# Altium project Antenna-V1.1.PrjPcb
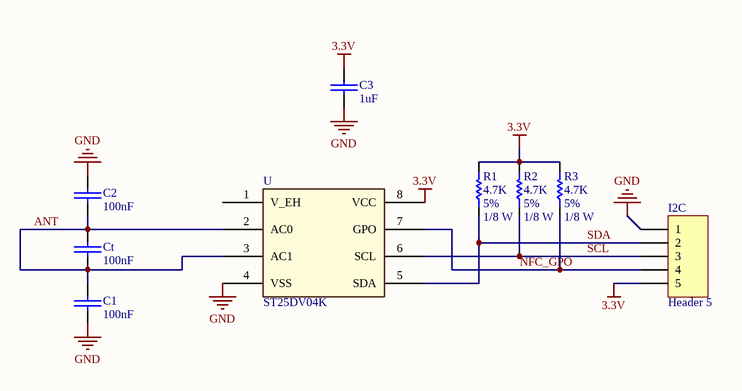
[diagram p0: Sheet1.SchDoc]
1 sheet, 9 parts. Net scope: global (net labels, ports and power ports of the same name join across sheets).
Board file: PCB1.PcbDoc

## Sheet Sheet1.SchDoc
size A3

### Parts
C1  100nF  [SMD_CAP_0805]
C2  100nF  [SMD_CAP_0805]
C3  1uF  [SMD_CAP_0805]
Ct  100nF  [SMD_CAP_0805]
I2C  Header 5  [HDR1X5]
R1  Tolerance: 5%  Power: 1/8 W  [RES 0805 (2012X06L)]  (hidden comment: 4.7K)
R2  Tolerance: 5%  Power: 1/8 W  [RES 0805 (2012X06L)]  (hidden comment: 4.7K)
R3  Tolerance: 5%  Power: 1/8 W  [RES 0805 (2012X06L)]  (hidden comment: 4.7K)
U  ST25DV04K  [PCBComponent_1]

### Nets
3.3V: C3.1(+) I2C.5 R1.2 R2.2 R3.2 U.8(VCC)
GND: C1.2(-) C2.1(+) C3.2(-) I2C.1 U.4(VSS)
ANT: C1.1(+) C2.2(-) Ct.1(+) Ct.2(-) U.2(AC0) U.3(AC1)
NFC_GPO: I2C.4 R3.1 U.7(GPO)
SCL: I2C.3 R2.1 U.6(SCL)
SDA: I2C.2 R1.1 U.5(SDA)

Not connected (* = marked no-connect by the designer): U 1(V_EH)

### Library data of the parts
C1-C3 Ct = Cap-Bipolar: Bipolar Capacitor; Voltage: 100V; Designer: Saeid Jorablo; Organazation: ControTec; Adding Date: 1387/12/20
  C1 C2 Ct: Value: 100nF
  C3: Value: 1uF
I2C = Header 5: Header, 5-Pin; LatestRevisionDate: 17-Jul-2002; LatestRevisionNote: Re-released for DXP Platform.; Publisher: Altium Limited
R1-R3 = Resistor: Value: 4.7K